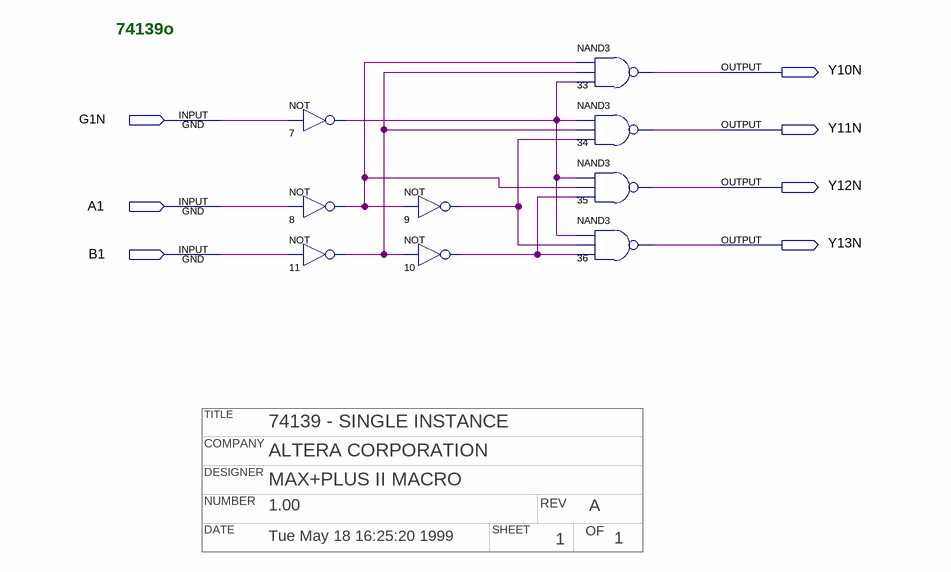
[diagram p0: schematic sheet]
// Quartus schematic 74139o.bdf as structural Verilog: 9 symbols, 7 pins
// Title block: TITLE: 74139 - SINGLE INSTANCE; COMPANY: ALTERA CORPORATION; DESIGNER: MAX+PLUS II MACRO; NUMBER: 1.00; REV: A; DATE: Tue May 18 16:25:20 1999; SHEET: 1; OF: 1
module \74139o  (
  input  G1N,
  input  A1,
  input  B1,
  output Y10N,
  output Y11N,
  output Y12N,
  output Y13N
);

  wire n7_out, n8_out, n9_out, n10_out, n11_out;

  not u_7 (n7_out, G1N);
  not u_8 (n8_out, A1);
  not u_11 (n11_out, B1);
  not u_9 (n9_out, n8_out);
  not u_10 (n10_out, n11_out);
  nand u_33 (Y10N, n8_out, n11_out, n7_out);
  nand u_34 (Y11N, n7_out, n11_out, n9_out);
  nand u_35 (Y12N, n7_out, n8_out, n10_out);
  nand u_36 (Y13N, n7_out, n9_out, n10_out);

  // Notes on the sheet:
  //   74139o
endmodule
